# EasyEDA Pro project ProProject_USB C Dongle_2024-03-22.epro

# Schematic PW_USB-C-M-JST_SUR4
Create Date: 2024-01-08; Page Name: P1; Project Name: USB C Dongle; Schematic Name: Schematic3; Update Date: 2024-01-07; Company: EasyEDA.com; Drawed: EasyEDA Pro; Page Size: A4; Part Number: JLCPCB-002; Reviewed: EasyEDA Pro; Version: V0.1
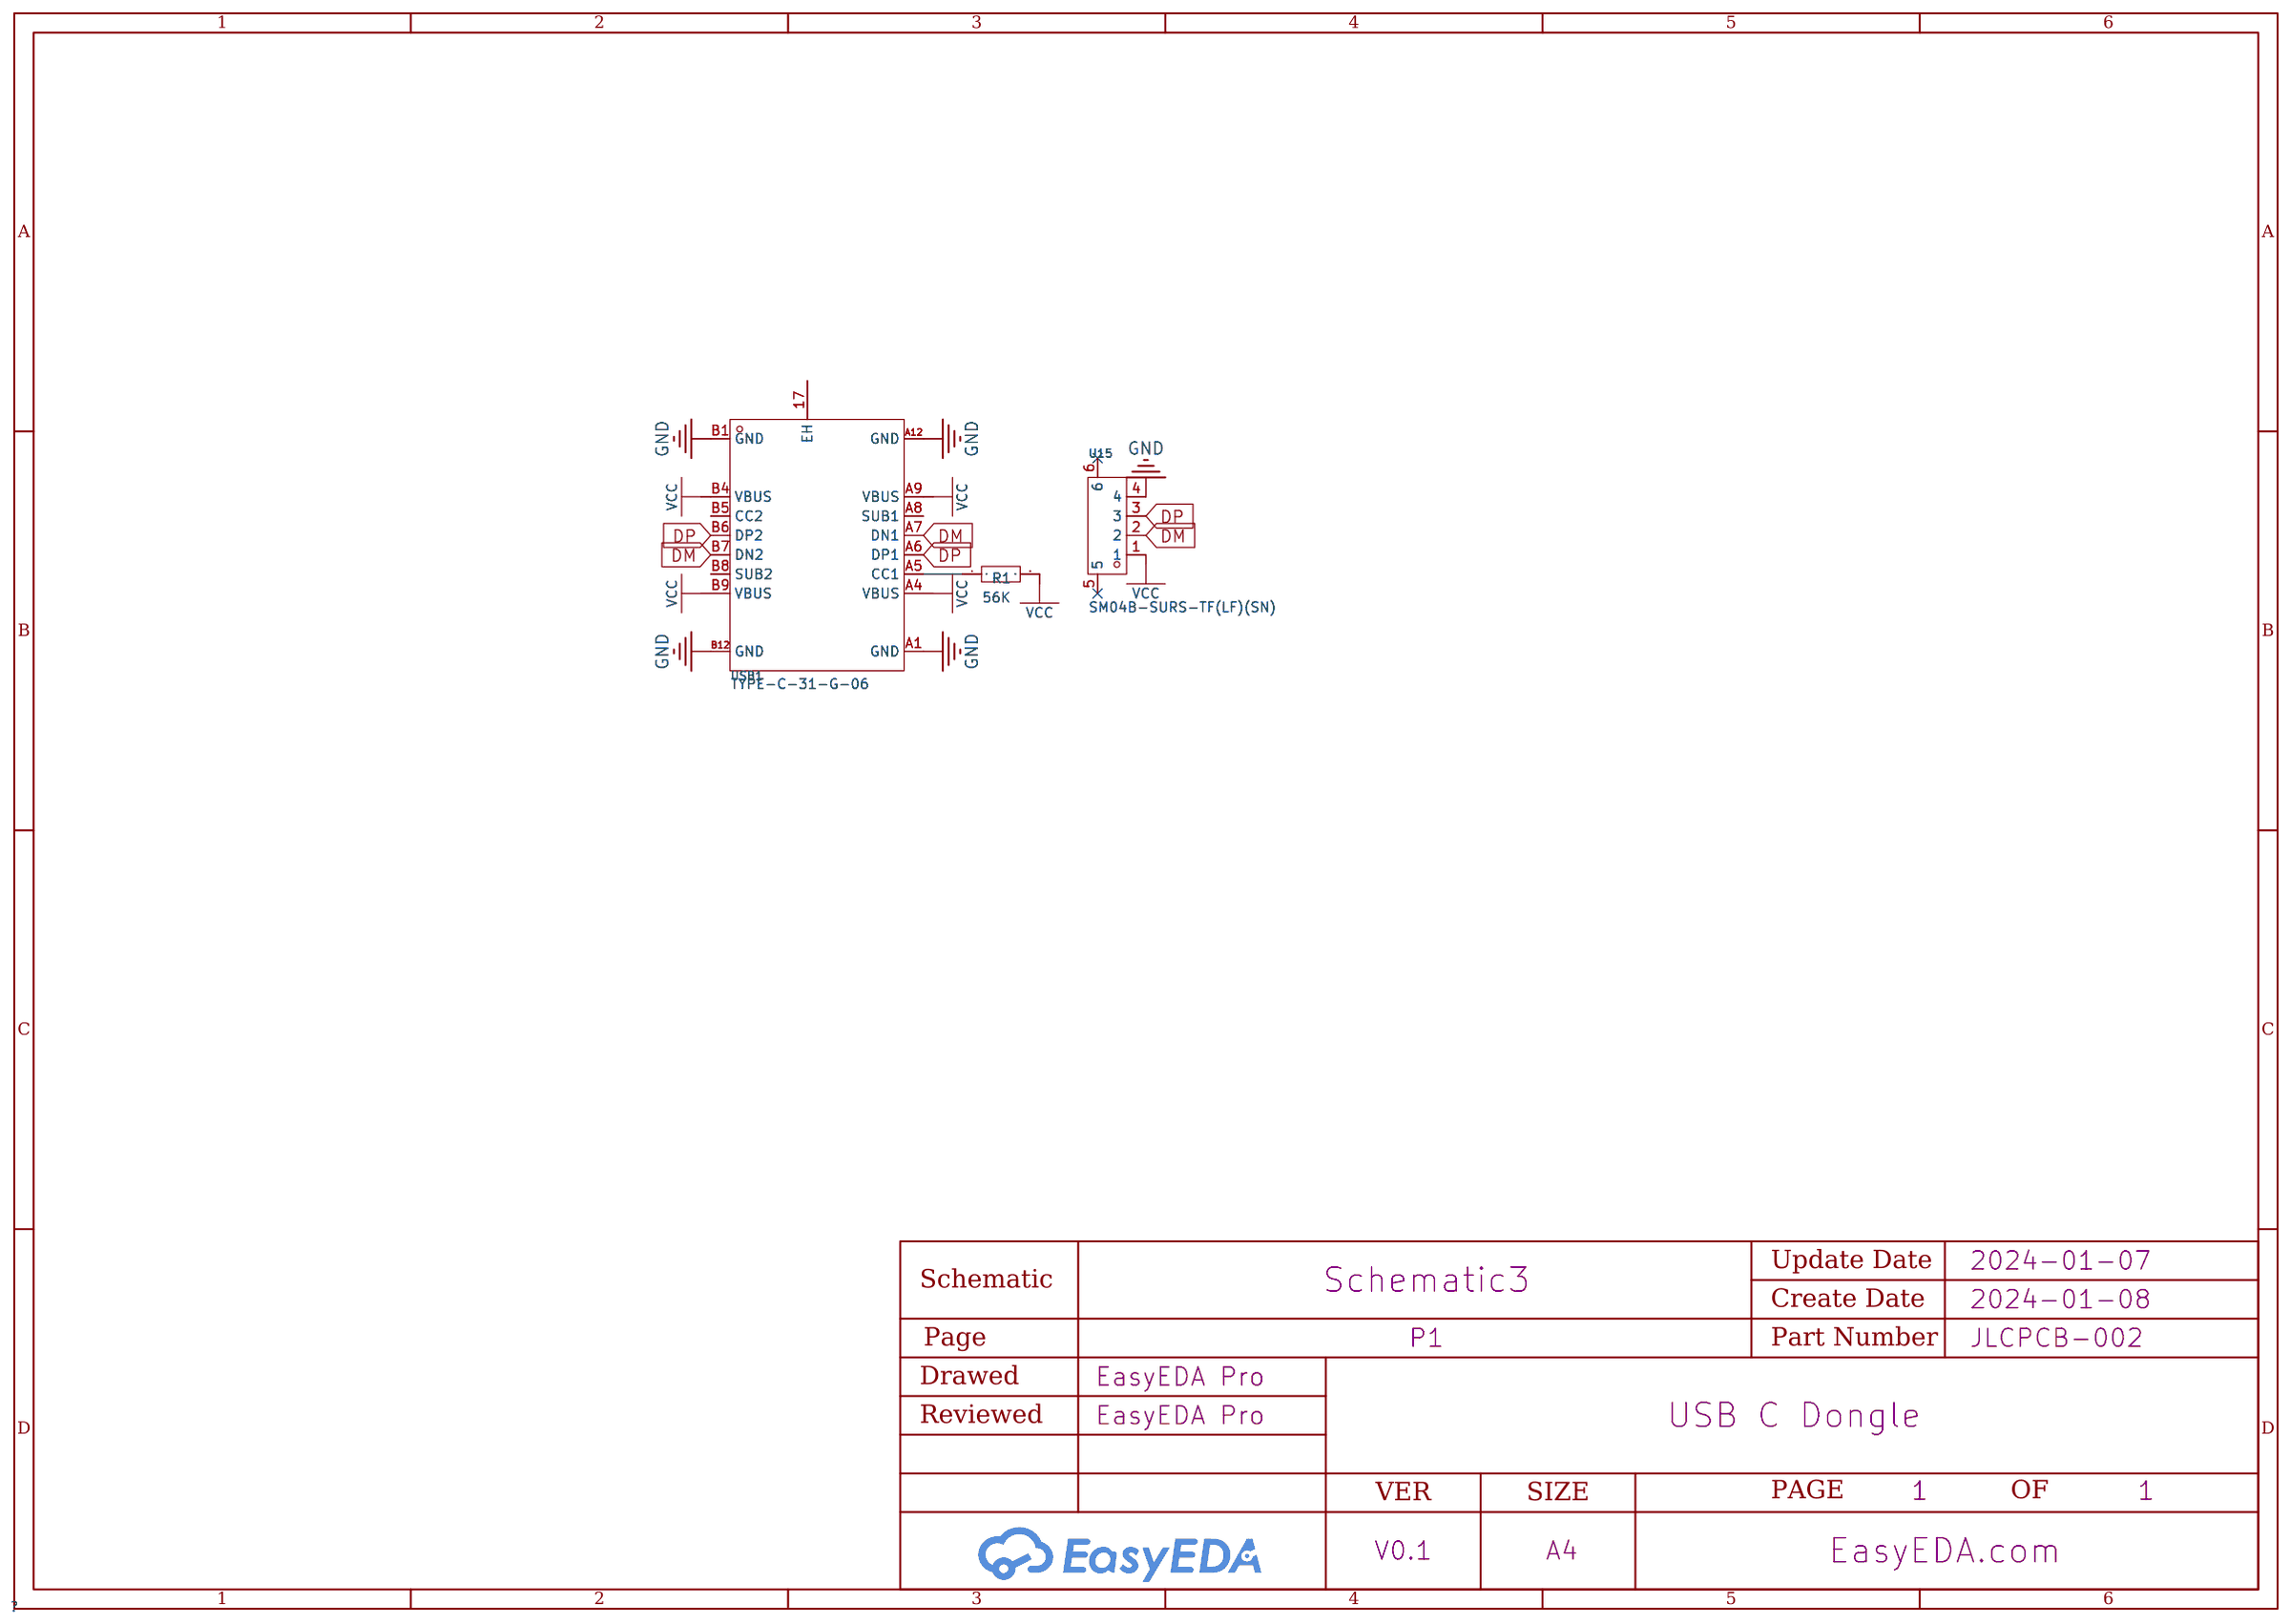
[diagram p0: schematic sheet]

## Parts
R1  56K  [R0201]
U15  SM04B-SURS-TF(LF)(SN)  [CONN-SMD_SM04B-SURS-TF-LF-SN]
USB1  TYPE-C-31-G-06  [USB-C-SMD_TYPE-C-31-G-06]

## Library data of the parts
R1 = Res_0201: Supplier Footprint: 0201
U15 = SM04B-SURS-TF(LF)(SN): PinsStructure:1x4PPitch:0.8mmGender:公MountingStyle:SurfaceMountRowSpacing:-NumberofRows:1NumberofPINsPerRow:4ReferenceSeries:-CurrentRating(Max):0.2AContactMaterial:CopperAlloyContactPlating:TinOperatingTemperatureRange:-25℃~+; LCSC Part Name: 1x4P间距:0.8mm卧贴; Supplier Part: C545754; Manufacturer: JST; Supplier Footprint: SMD,P=0.8mm; JLCPCB Part Class: ExtendedPart; Datasheet: https://atta.szlcsc.com/upload/public/pdf/source/20200721/C545754_707EF2DB36147EA26D9225FCA163A6BC.pdf; Supplier: LCSC; Pins Structure: 1x4P; Pitch: 0.8mm; Gender: 公; Mounting Style: SurfaceMount; Number of Rows: 1; Number of PINs Per Row: 4; Current Rating (Max): 0.2A; Contact Material: CopperAlloy; Contact Plating: Tin; Operating Temperature Range: -25℃~+85℃
USB1 = TYPE-C-31-G-06: Connector Type:Type-C Standard:- Gender:公 Number of Contacts:24P Number of Ports:1 Current Rating - Power (Max):500mA; LCSC Part Name: Type-C 公; Supplier Part: C283539; Manufacturer: 韩国韩荣; Supplier Footprint: SMD; JLCPCB Part Class: Extended Part; Datasheet: https://atta.szlcsc.com/upload/public/pdf/source/20210810/CA99BD783064C6B4641AB25B47B89EE7.pdf; Supplier: LCSC; Connector Type: Type-C; Gender: 公; Number of Contacts: 24P; Number of Ports: 1; Current Rating - Power (Max): 500mA

## Nets
GND: U15.4 USB1.A1(GND) USB1.A12(GND) USB1.B1(GND) USB1.B12(GND)
VCC: R1.2 U15.1 USB1.A4(VBUS) USB1.A9(VBUS) USB1.B4(VBUS) USB1.B9(VBUS)
DM: U15.2 USB1.A7(DN1) USB1.B7(DN2)
DP: U15.3 USB1.A6(DP1) USB1.B6(DP2)
$1N357: R1.1 USB1.A5(CC1)

Not connected (* = marked no-connect by the designer): U15 5* 6*; USB1 17(EH) A8(SUB1) B5(CC2) B8(SUB2)

# Schematic USB-C-M-F_JST_SUR6
Create Date: 2024-01-08; Page Name: P1; Project Name: USB C Dongle; Schematic Name: USB-C-M-F_JST_SUR6; Update Date: 2024-01-07; Company: EasyEDA.com; Drawed: EasyEDA Pro; Page Size: A4; Part Number: JLCPCB-002; Reviewed: EasyEDA Pro; Version: V0.1
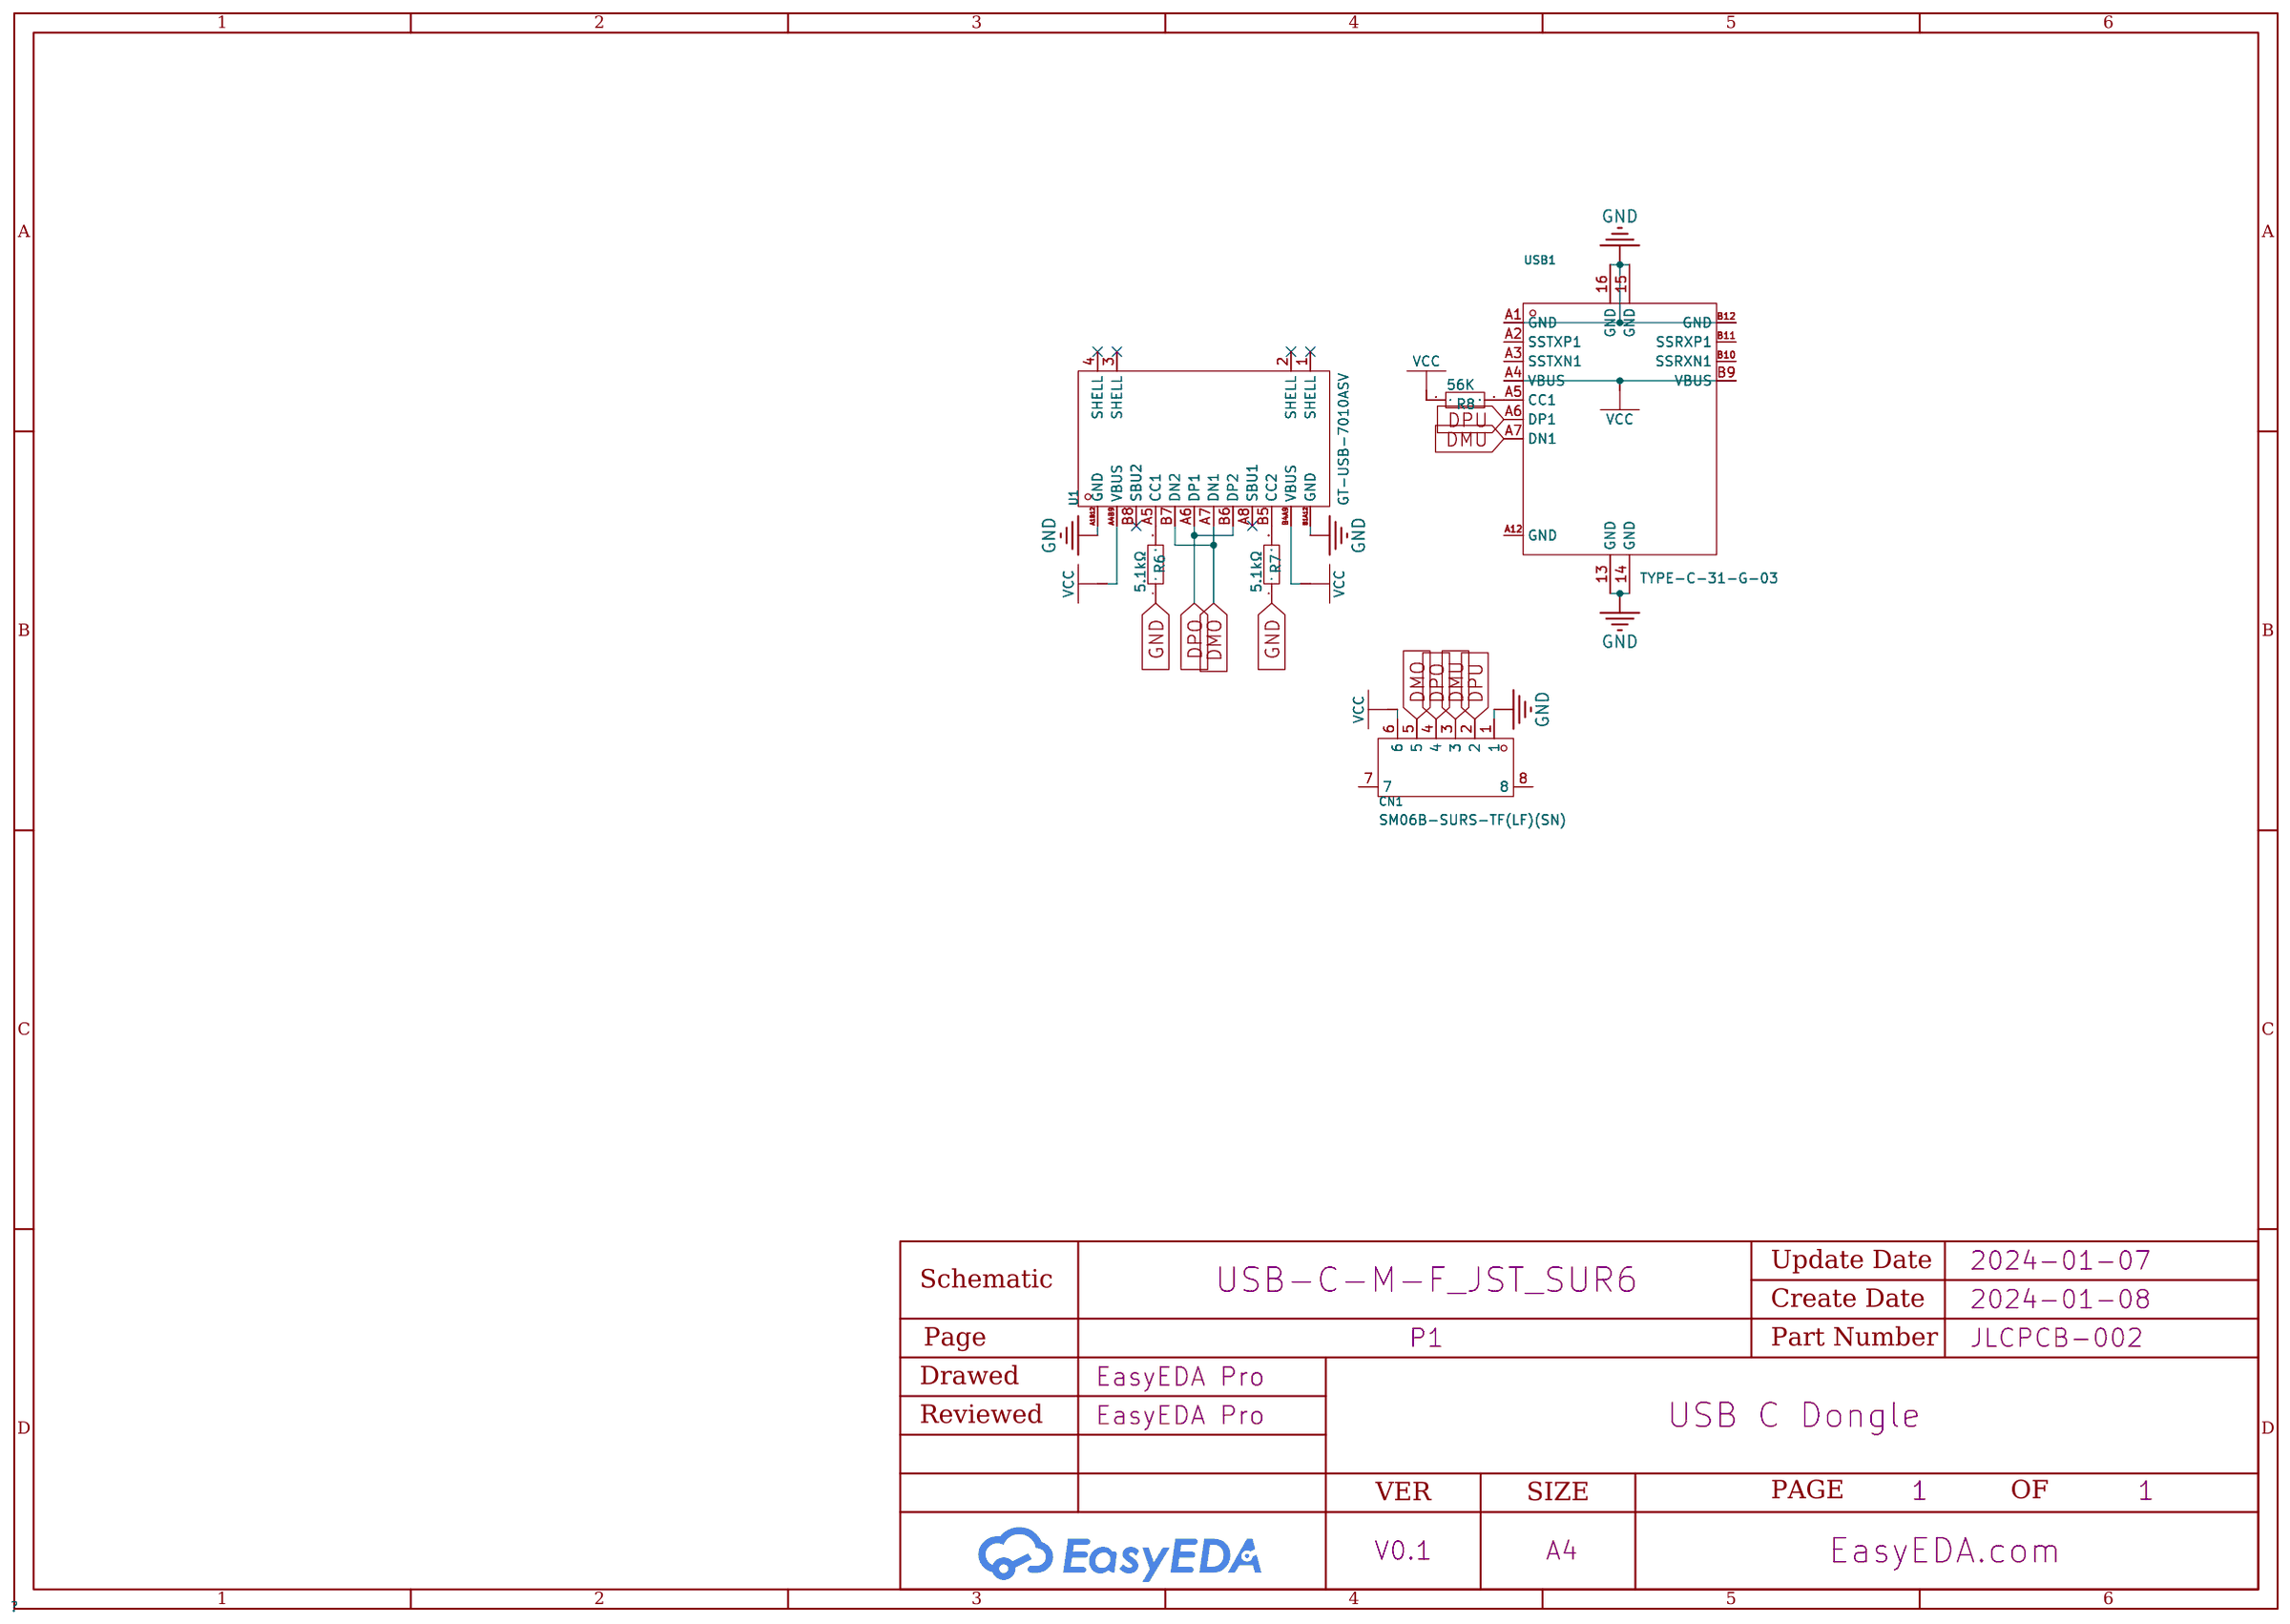
[diagram p1: schematic sheet]

## Parts
CN1  SM06B-SURS-TF(LF)(SN)  [CONN-SMD_SM06B-SURS-TF-LF-SN]
R6  5.1kΩ  [R0402]
R7  5.1kΩ  [R0402]
R8  56K  [R0402]
U1  GT-USB-7010ASV  [USB-C-SMD_G-SWITCH_GT-USB-7010ASV]
USB1  TYPE-C-31-G-03  [USB-C-SMD_TYPE-C-31-G-03]

## Library data of the parts
CN1 = SM06B-SURS-TF(LF)(SN): Pins Structure:1x6P Pitch:0.8mm Mounting Style:Surface Mount Row Spacing:- Number of Pins:6P Number of Rows:1 Number of PINs Per Row:6 Reference Series:- Current Rating (Max):0.2A Contact Material:Copper Alloy Contact Plating:Tin Operating Temperature Ran; LCSC Part Name: 1x6P 间距:0.8mm 卧贴; Supplier Part: C495545; Manufacturer: JST; Supplier Footprint: SMD,P=0.8mm; JLCPCB Part Class: Extended Part; Datasheet: https://atta.szlcsc.com/upload/public/pdf/source/20200311/C495545_E72935403D1EB49F793AD89C21E66448.pdf; Supplier: LCSC; Pins Structure: 1x6P; Pitch: 0.8mm; Mounting Style: Surface Mount; Number of Pins: 6P; Number of Rows: 1; Number of PINs Per Row: 6; Current Rating (Max): 0.2A; Contact Material: Copper Alloy; Contact Plating: Tin; Operating Temperature Range: -25℃~+85℃
R6-R8 = Res_0402: Supplier Footprint: 0402
U1 = GT-USB-7010ASV: Connector Type:Type-C Standard:USB 2.0 Gender:Female Number of Contacts:16P Number of Ports:1 Mounting Style:Surface Mount Current Rating - Power (Max):3A Contact Material:高导铜 Contact Plating:Gold Operating Temperature Range:-40℃~+85℃ Operating Temperatur; LCSC Part Name: Type-C 母 卧贴; Supplier Part: C2988369; Manufacturer: G-Switch(品赞); Supplier Footprint: SMD; JLCPCB Part Class: Extended Part; Datasheet: https://atta.szlcsc.com/upload/public/pdf/source/20230327/DF227B64686AC8FA0AD1775797F2C3F1.pdf; Supplier: LCSC; Connector Type: Type-C; Standard: USB 2.0; Gender: Female; Number of Contacts: 16P; Number of Ports: 1; Mounting Style: Surface Mount; Current Rating - Power (Max): 3A; Contact Material: 高导铜; Contact Plating: Gold; Operating Temperature Range: -40℃~+85℃
USB1 = TYPE-C-31-G-03: Connector Type:Type-C Standard:- Gender:公 Number of Contacts:- Number of Ports:1 Mounting Style:Surface Mount Current Rating - Power (Max):- Operating Temperature Range:- Operating Temperature Range:-; LCSC Part Name: Type-C 公 卧贴; Supplier Part: C840338; Manufacturer: 韩国韩荣; Supplier Footprint: SMD; JLCPCB Part Class: Extended Part; Datasheet: https://atta.szlcsc.com/upload/public/pdf/source/20210810/E47A9575BD3E836507301D4DB0C733BA.pdf; Supplier: LCSC; Connector Type: Type-C; Gender: 公; Number of Ports: 1; Mounting Style: Surface Mount

## Nets
GND: CN1.1 R6.1 R7.1 U1.A1B12(GND) U1.B1A12(GND) USB1.13(GND) USB1.14(GND) USB1.15(GND) USB1.16(GND) USB1.A1(GND) USB1.B12(GND)
VCC: CN1.6 R8.1 U1.A4B9(VBUS) U1.B4A9(VBUS) USB1.A4(VBUS) USB1.B9(VBUS)
DMO: CN1.5 U1.A7(DN1) U1.B7(DN2)
DMU: CN1.3 USB1.A7(DN1)
DPO: CN1.4 U1.A6(DP1) U1.B6(DP2)
DPU: CN1.2 USB1.A6(DP1)
$1N314: R6.2 U1.A5(CC1)
$1N351: R7.2 U1.B5(CC2)
$1N1066: R8.2 USB1.A5(CC1)

Not connected (* = marked no-connect by the designer): CN1 7 8; U1 1(SHELL)* 2(SHELL)* 3(SHELL)* 4(SHELL)* A8(SBU1)* B8(SBU2)*; USB1 A2(SSTXP1) A3(SSTXN1) A12(GND) B10(SSRXN1) B11(SSRXP1)

# Board PCB2
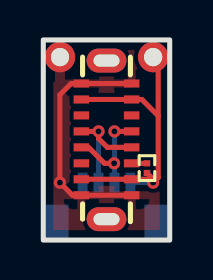
[diagram p2: board, top side]
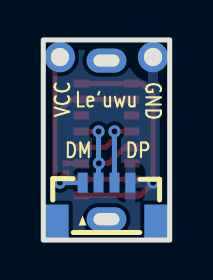
[diagram p3: board, bottom side, seen from below]

Outline 6.35 x 10.03 mm; copper layers: Top Layer, Bottom Layer. Coordinates in mm from the lower left corner of the outline.
Outline path: rectangle 0,10.03 6.35,0
Stack: Top Layer 0.035mm / Dielectric1 1.51mm FR4 er 4.5 / Bottom Layer 0.035mm

## Design rules (mm)
template: JLCPCB Capability(Two Layers Board)
spacing copperThickness1oz (default): track to track 0.102, other pairs 0.152 to 0.3
spacing copperThickness2oz: track to track 0.203, other pairs 0.152 to 0.3
track width copperThickness1oz (default): min 0.127, default 0.254, max 2.54
track width copperThickness2oz: min 0.203, default 0.254, max 2.54
differential pair differentialPair (default): width min 0.127, default 0.254, max 2.54; gap min 0.152, default 0.152
via viaSize (default): diameter min 0.5, default 0.61, max 10; hole min 0.3, default 0.305, max 6.3

## Placement (name value [footprint] x y rotation side)
NOREF  -  [Pad_e72]  0.84 9.17 0 top
NOREF#2  -  [Pad_e73]  5.52 9.17 0 top
R1  56K  [R0201]  5.21 3.61 270 top
U15  SM04B-SURS-TF(LF)(SN)  [CONN-SMD_SM04B-SURS-TF-LF-SN]  3.18 1.91 180 bottom
USB1  TYPE-C-31-G-06  [USB-C-SMD_TYPE-C-31-G-06]  3.18 5.02 0 top

## Footprints (pads in the part's own frame, mm; a bottom-side part is the same pattern mirrored in y, then rotated)
CONN-SMD_SM04B-SURS-TF-LF-SN
  rect 0.5x1 smd: 1(-1.2,0.975) 2(-0.4,0.975) 3(0.4,0.975) 4(1.2,0.975)
  rect 1.2x1.7 smd: 5(2.5,-0.975) 6(-2.5,-0.975)
Pad_e72
  round 1.524 hole 0.914: 7(0,0)
Pad_e73
  round 1.524 hole 0.914: 8(0,0)
R0201
  rect 0.303x0.324 smd: 1(-0.241,0) 2(0.241,0)
USB-C-SMD_TYPE-C-31-G-06
  oval 2x1.2 hole 1.3x0.6: 17(0,3.975) 17(0,-3.975)
  rect 0.775x0.4 smd: A1(1.263,-2.775) A4(1.263,-1.975) A5(1.263,-1.175) A6(1.263,-0.375) A7(1.263,0.425) A8(1.263,1.225) A9(1.263,2.025) A12(1.263,2.825) B1(-1.263,2.825) B4(-1.263,2.025) B5(-1.263,1.225) B6(-1.263,0.425) B7(-1.263,-0.375) B8(-1.263,-1.175) B9(-1.263,-1.975) B12(-1.263,-2.775)

## Nets
GND: NOREF.7 U15.4 USB1.A1 USB1.A12 USB1.B1 USB1.B12
VCC: NOREF#2.8 R1.2 U15.1 USB1.A4 USB1.A9 USB1.B4 USB1.B9
DM: U15.2 USB1.A7 USB1.B7
DP: U15.3 USB1.A6 USB1.B6
$1N357: R1.1 USB1.A5

Pads without a net: U15 5 6; USB1 17 A8 B5 B8

## Via types
v1: diameter 0.61, hole 0.305, Top Layer to Bottom Layer, 5 vias

## Routing (per net, layer and track width the routed paths; a pad name or vN(x,y) marks a point on that pad's centre or on a via; arc(x,y) is an arc through that point)
GND: length 12.1
  Top Layer w0.254: 4.44,2.25 1.46,2.25 v1(0.83,2.88) 0.83,7.28 1.4,7.85 USB1.B1 USB1.A12
VCC: length 16.3
  Top Layer w0.254: 5.39,9.17 5.77,8.79 5.77,6.23 ; R1.2 5.52,3.05 v1(5.52,2.88) ; v1(5.52,2.88) 5.44,2.88 5.28,3.05 USB1.A4 USB1.B9 ; v1(5.52,2.88) 5.77,3.13 5.77,6.23 ; 5.77,6.23 4.95,7.05 USB1.A9 USB1.B4
  Bottom Layer w0.254: U15.1 v1(5.52,2.88) 5.52,2.81
DM: length 5.6
  Top Layer w0.254: v1(3.56,3.85) 3.07,3.85 2.27,4.65 USB1.B7 ; v1(3.57,5.45) 4.44,5.45
  Bottom Layer w0.254: 3.57,5.59 3.57,3.96 3.56,3.94 3.57,3.92 U15.2
DP: length 5.7
  Top Layer w0.254: USB1.A6 3.22,4.65 2.78,5.09 v1(2.78,5.45) 1.91,5.45
  Bottom Layer w0.254: 2.78,5.5 U15.3
$1N357: length 0.8
  Top Layer w0.254: 5.22,3.85 USB1.A5

## Copper pours and planes (outline as drawn; the poured copper is in the pictures)
GND on Top Layer: -1.78,11.94 6.48,11.94 6.48,-0.13 -1.78,-0.13
GND on Bottom Layer: -0.28,10.26 7.97,10.26 7.97,-1.8 -0.28,-1.8

## Text on the board
Bottom Silkscreen Layer: Le'uwu | GND | VCC | DP | DM

# Board PCB1
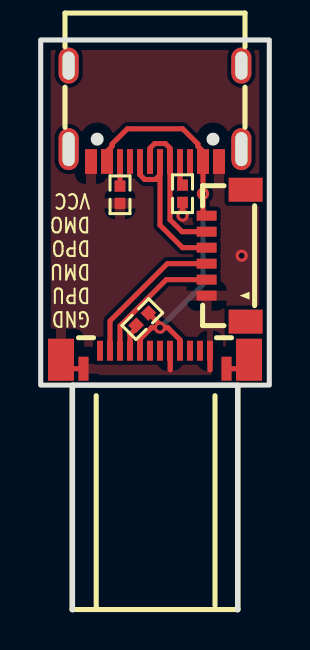
[diagram p4: board, top side]
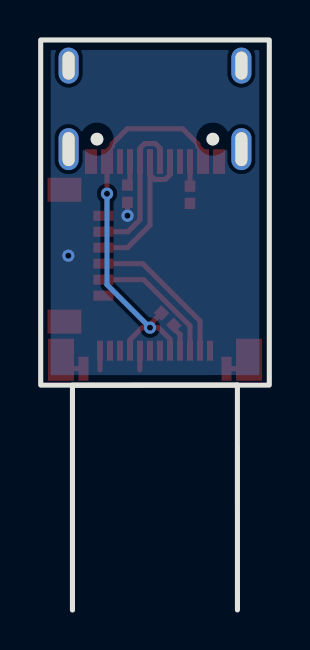
[diagram p5: board, bottom side, seen from below]

Outline 11.43 x 28.53 mm; copper layers: Top Layer, Bottom Layer. Coordinates in mm from the lower left corner of the outline.
Outline path: rectangle 0,28.53 11.43,11.26
Stack: Top Layer 0.035mm / Dielectric1 1.51mm FR4 er 4.5 / Bottom Layer 0.035mm

## Design rules (mm)
template: JLCPCB Capability(Two Layers Board)
spacing copperThickness1oz (default): track to track 0.102, other pairs 0.152 to 0.3
spacing copperThickness2oz: track to track 0.203, other pairs 0.152 to 0.3
track width copperThickness1oz (default): min 0.127, default 0.254, max 2.54
track width copperThickness2oz: min 0.203, default 0.254, max 2.54
differential pair differentialPair (default): width min 0.127, default 0.254, max 2.54; gap min 0.152, default 0.152
via viaSize (default): diameter min 0.5, default 0.61, max 10; hole min 0.3, default 0.305, max 6.3

## Placement (name value [footprint] x y rotation side)
CN1  SM06B-SURS-TF(LF)(SN)  [CONN-SMD_SM06B-SURS-TF-LF-SN]  9.27 17.73 90 top
R6  5.1kΩ  [R0402]  7.09 20.83 90 top
R7  5.1kΩ  [R0402]  3.97 20.78 90 top
R8  56K  [R0402]  5.08 14.56 225 top
U1  GT-USB-7010ASV  [USB-C-SMD_G-SWITCH_GT-USB-7010ASV]  5.72 24.84 180 top
USB1  TYPE-C-31-G-03  [USB-C-SMD_TYPE-C-31-G-03]  5.72 12.53 0 top

## Footprints (pads in the part's own frame, mm; a bottom-side part is the same pattern mirrored in y, then rotated)
CONN-SMD_SM06B-SURS-TF-LF-SN
  rect 0.5x1 smd: 1(-2,0.975) 2(-1.2,0.975) 3(-0.4,0.975) 4(0.4,0.975) 5(1.2,0.975) 6(2,0.975)
  rect 1.2x1.7 smd: 7(3.3,-0.975) 8(-3.3,-0.975)
R0402
  rect 0.566x0.54 smd: 1(-0.433,0) 2(0.433,0)
USB-C-SMD_G-SWITCH_GT-USB-7010ASV
  oval 1x2.1 hole 0.6x1.7: 1(-4.32,1.78) 2(4.32,1.78)
  oval 1x1.8 hole 0.6x1.4: 3(4.32,-2.4) 4(-4.32,-2.4)
  rect 0.6x1.24 smd: A1B12(-3.2,2.4) A4B9(-2.4,2.4) B1A12(3.2,2.4) B4A9(2.4,2.4)
  rect 0.3x1.24 smd: A5(-1.25,2.4) A6(-0.25,2.4) A7(0.25,2.4) A8(1.25,2.4) B5(1.75,2.4) B6(0.75,2.4) B7(-0.75,2.4) B8(-1.75,2.4)
USB-C-SMD_TYPE-C-31-G-03
  rect 0.5x1.2 smd: 13(-3.575,-0.45) 16(3.575,-0.45)
  rect 1.3x2.1 smd: 14(-4.7,0) 15(4.7,0)
  rect 0.3x1 smd: A1(2.75,0.45) A2(2.25,0.45) A3(1.75,0.45) A4(1.25,0.45) A5(-1.25,0.45) A6(-1.75,0.45) A7(-2.25,0.45) A12(-2.75,0.45) B9(-0.75,0.45) B10(-0.25,0.45) B11(0.25,0.45) B12(0.75,0.45)

## Nets
As in the schematic.

Pads without a net: CN1 7 8; U1 1 2 3 4 A8 B8; USB1 A2 A3 A12 B10 B11

## Via types
v1: diameter 0.61, hole 0.305, Top Layer to Bottom Layer, 4 vias

## Routing (per net, layer and track width the routed paths; a pad name or vN(x,y) marks a point on that pad's centre or on a via; arc(x,y) is an arc through that point)
GND: length 5.2
  Top Layer w0.254: USB1.B12 6.48,12.96 6.48,12.02 ; USB1.14 1.47,12.08 USB1.13 ; USB1.16 9.97,12.08 USB1.15 ; USB1.A1 8.47,12.02 ; v1(7.09,19.73) R6.1
  vias: v1(10.05,17.73)
VCC: length 21.9
  Top Layer w0.254: v1(5.97,14.13) 5.54,14.13 4.97,13.55 USB1.B9 ; v1(5.97,14.13) 6.35,14.13 6.97,13.52 USB1.A4 ; v1(5.97,14.13) 5.97,14.28 R8.1 ; CN1.6 8.12,19.91 v1(8.12,20.83) U1.A4B9 8.12,22.95 7.86,23.21 7.86,23.32 7.1,24.08 4.33,24.08 3.57,23.32 3.57,23.21 3.31,22.95 U1.B4A9
  Bottom Layer w0.254: v1(8.12,20.83) 8.12,16.28 v1(5.97,14.13)
DMO: length 7.5
  Top Layer w0.254: CN1.5 7.07,18.93 6.47,19.53 U1.B7 6.47,23.11 6.23,23.34 5.7,23.34 5.46,23.11 5.46,22.45 U1.A7
DMU: length 7.5
  Top Layer w0.254: USB1.A7 3.47,14.47 6.33,17.33 CN1.3
DPO: length 7.9
  Top Layer w0.254: CN1.4 7.09,18.13 5.97,19.26 5.97,21.78 ; U1.A6 5.97,21.78 ; 5.97,21.78 5.73,21.55 5.2,21.55 4.95,21.79 4.95,22.43 U1.B6
DPU: length 6.5
  Top Layer w0.254: CN1.2 6.28,16.53 3.97,14.22 USB1.A6
$1N314: length 1.2
  Top Layer w0.254: 6.97,21.27 U1.A5
$1N351: length 1.2
  Top Layer w0.254: R7.2 U1.B5
$1N1066: length 1.4
  Top Layer w0.254: 4.47,13.79 4.77,14.1 4.77,14.25 ; 4.47,13.79 4.46,13.8 ; 4.47,13.79 USB1.A5

## Copper pours and planes (outline as drawn; the poured copper is in the pictures)
GND on Top Layer: 0,28.53 12.32,28.53 12.32,10.49 0,10.49
GND on Bottom Layer: -1.4,29.8 11.43,29.8 11.43,11.13 -1.4,11.13

## Text on the board
Top Silkscreen Layer: GND / DPU / DMU / DPO / DMO / VCC
